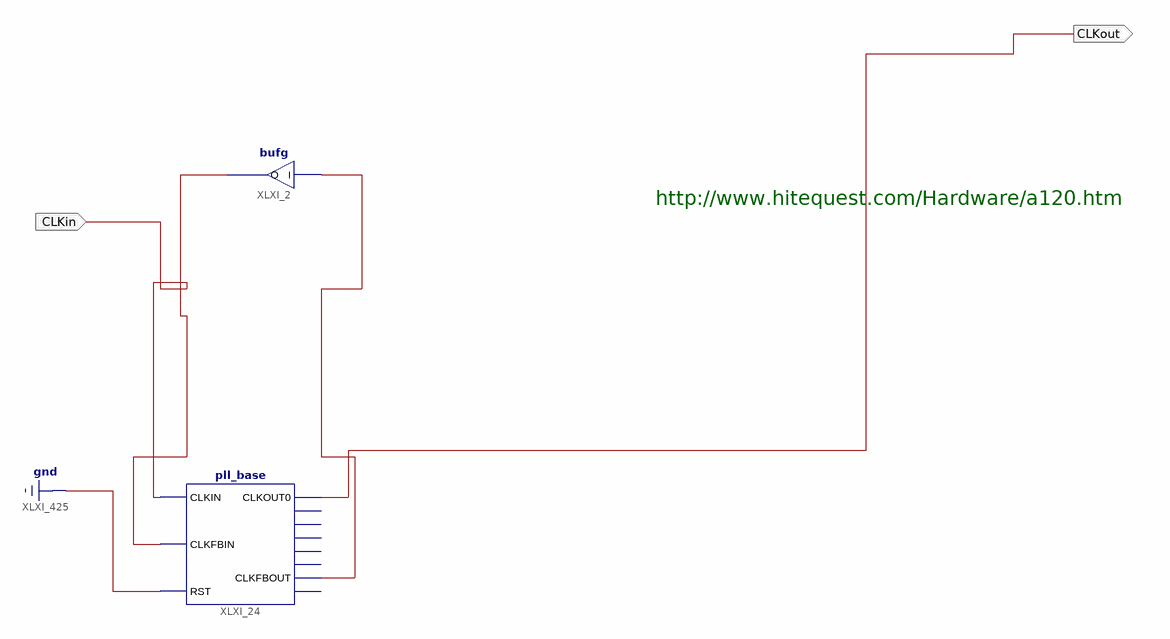
[diagram p0: schematic sheet 1]
// Xilinx ISE schematic divideby3.sch (spartan6) as structural Verilog: 2 symbols, 2 ports
module divideby3 (
  input  CLKin,
  output CLKout
);

  wire XLXN_26, XLXN_27;

  bufg XLXI_2 (.I(XLXN_27), .O(XLXN_26));
  pll_base #(.CLKOUT0_DIVIDE(24), .CLKIN_PERIOD(20), .CLKFBOUT_MULT(8), .BANDWIDTH("OPTIMIZED"), .REF_JITTER(0), .COMPENSATION("SOURCE_SYNCHRONOUS")) XLXI_24 (
    .CLKIN(CLKin), .CLKFBIN(XLXN_26), .RST(1'b0), .CLKOUT0(CLKout), .CLKFBOUT(XLXN_27));  // open: CLKOUT1, CLKOUT2, CLKOUT3, CLKOUT4, CLKOUT5, LOCKED

  // Notes on the sheet:
  //   http://www.hitequest.com/Hardware/a120.htm
endmodule
